# Altium schematic sheet AnalogSense.SchDoc: =TITLE
size A3; DocumentNumber: 11; SheetNumber: 11; SheetTotal: 11
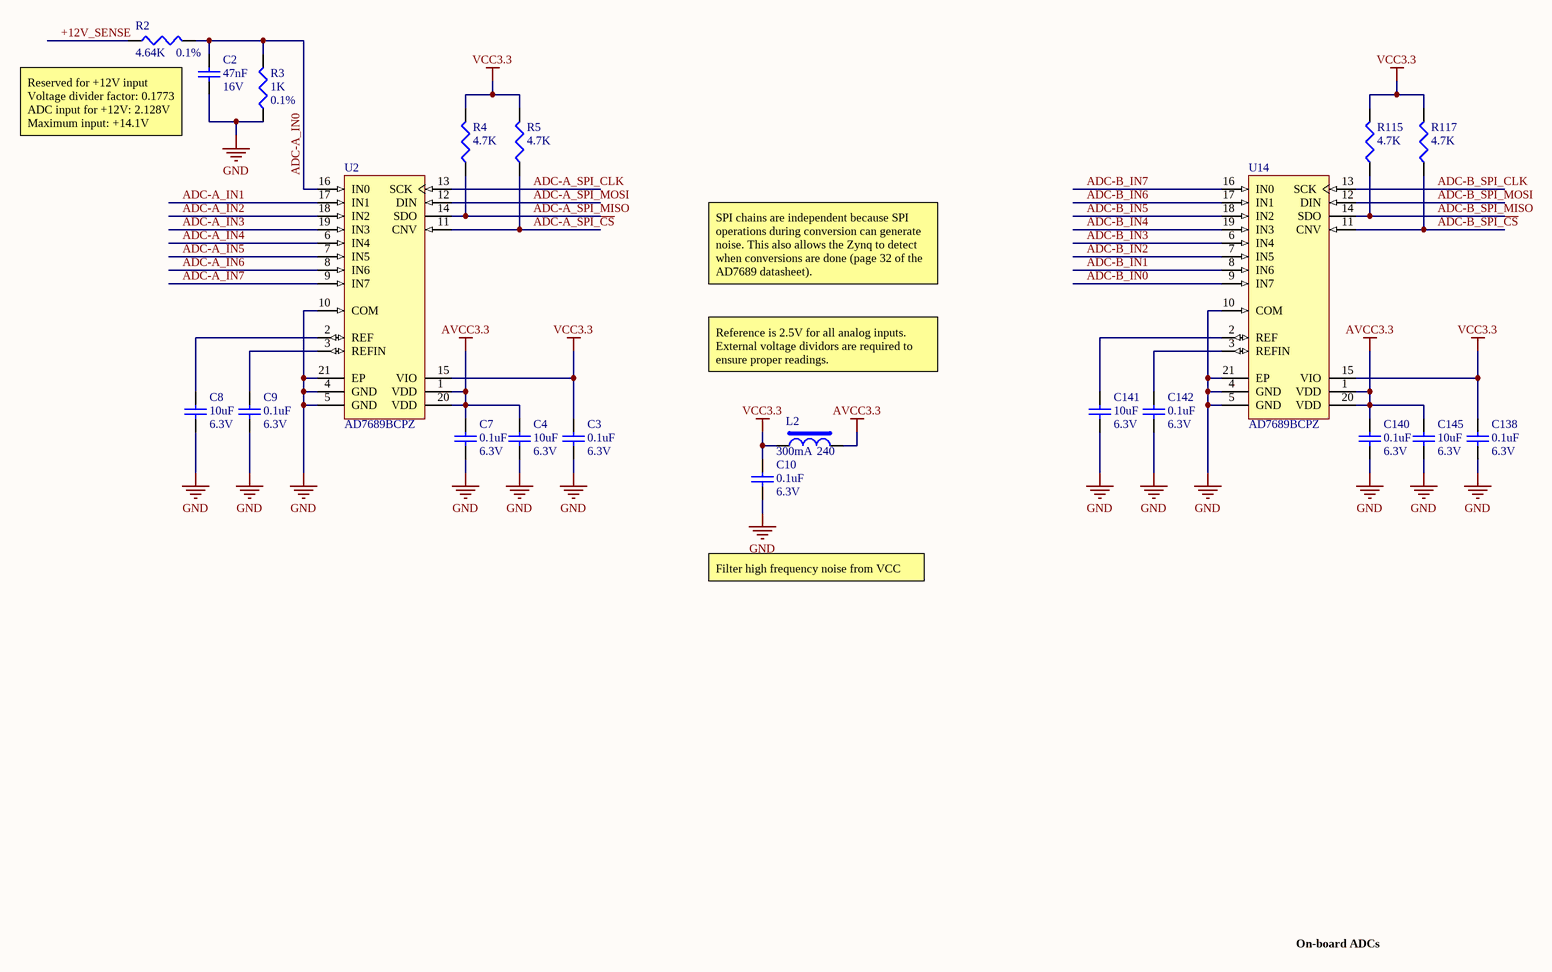
[diagram p0: AnalogSense.SchDoc]

## Parts
C2  value 47nF  Rating: 16V  [C0402_IPC_H]  (hidden comment: ?)
C3  value 0.1uF  Rating: 6.3V  [C0201_IPC_H]  (hidden comment: ?)
C4  value 10uF  Rating: 6.3V  [C0402_IPC_H]  (hidden comment: ?)
C7  value 0.1uF  Rating: 6.3V  [C0201_IPC_H]  (hidden comment: ?)
C8  value 10uF  Rating: 6.3V  [C0402_IPC_H]  (hidden comment: ?)
C9  value 0.1uF  Rating: 6.3V  [C0201_IPC_H]  (hidden comment: ?)
C10  value 0.1uF  Rating: 6.3V  [C0201_IPC_H]  (hidden comment: ?)
C138  value 0.1uF  Rating: 6.3V  [C0201_IPC_H]  (hidden comment: ?)
C140  value 0.1uF  Rating: 6.3V  [C0201_IPC_H]  (hidden comment: ?)
C141  value 10uF  Rating: 6.3V  [C0402_IPC_H]  (hidden comment: ?)
C142  value 0.1uF  Rating: 6.3V  [C0201_IPC_H]  (hidden comment: ?)
C145  value 10uF  Rating: 6.3V  [C0402_IPC_H]  (hidden comment: ?)
L2  value 240  Rated Current: 300mA  [L0402_H]  (hidden comment: BK1005HM241-T)
R2  value 4.64K  Tolerance: 0.1%  [R0603]  (hidden comment: ?)
R3  value 1K  Tolerance: 0.1%  [R0402_IPC_H]  (hidden comment: ?)
R4  value 4.7K  [R0402_IPC_H]  (hidden comment: ?)
R5  value 4.7K  [R0402_IPC_H]  (hidden comment: ?)
R115  value 4.7K  [R0402_IPC_H]  (hidden comment: ?)
R117  value 4.7K  [R0402_IPC_H]  (hidden comment: ?)
U2  AD7689BCPZ  [CP-20-4_N]
U14  AD7689BCPZ  [CP-20-4_N]

## Nets
AVCC3.3: C4.2 C7.2 C140.2 C145.2 L2.2 U2.1(VDD) U2.20(VDD) U14.1(VDD) U14.20(VDD)
GND: C2.1 C3.1 C4.1 C7.1 C8.1 C9.1 C10.1 C138.1 C140.1 C141.1 C142.1 C145.1 R3.1 U2.4(GND) U2.5(GND) U2.10(COM) U2.21(EP) U14.4(GND) U14.5(GND) U14.10(COM) U14.21(EP)
VCC3.3: C3.2 C10.2 C138.2 L2.1 R4.2 R5.2 R115.2 R117.2 U2.15(VIO) U14.15(VIO)
+12V_SENSE: R2.1
~{ADC-A_SPI_CS}: R5.1 U2.11(CNV)
~{ADC-B_SPI_CS}: R117.1 U14.11(CNV)
ADC-A_IN0: C2.2 R2.2 R3.2 U2.16(IN0)
ADC-A_IN1: U2.17(IN1)
ADC-A_IN2: U2.18(IN2)
ADC-A_IN3: U2.19(IN3)
ADC-A_IN4: U2.6(IN4)
ADC-A_IN5: U2.7(IN5)
ADC-A_IN6: U2.8(IN6)
ADC-A_IN7: U2.9(IN7)
ADC-A_SPI_CLK: U2.13(SCK)
ADC-A_SPI_MISO: R4.1 U2.14(SDO)
ADC-A_SPI_MOSI: U2.12(DIN)
ADC-B_IN0: U14.9(IN7)
ADC-B_IN1: U14.8(IN6)
ADC-B_IN2: U14.7(IN5)
ADC-B_IN3: U14.6(IN4)
ADC-B_IN4: U14.19(IN3)
ADC-B_IN5: U14.18(IN2)
ADC-B_IN6: U14.17(IN1)
ADC-B_IN7: U14.16(IN0)
ADC-B_SPI_CLK: U14.13(SCK)
ADC-B_SPI_MISO: R115.1 U14.14(SDO)
ADC-B_SPI_MOSI: U14.12(DIN)
NetC8_2: C8.2 U2.2(REF)
NetC9_2: C9.2 U2.3(REFIN)
NetC141_2: C141.2 U14.2(REF)
NetC142_2: C142.2 U14.3(REFIN)

## Notes on the sheet
- Reserved for +12V input
  Voltage divider factor: 0.1773
  ADC input for +12V: 2.128V
  Maximum input: +14.1V
- SPI chains are independent because SPI operations during conversion can generate noise. This also allows the Zynq to detect when conversions are done (page 32 of the AD7689 datasheet).
- Reference is 2.5V for all analog inputs. External voltage dividors are required to ensure proper readings.
- Filter high frequency noise from VCC
- On-board ADCs
- Description
- Title
- Size:
- Date:
- A3
- Number:
- Time:
- Revision:
- Sheet
- of
- File:
- Author:

## Library data of the parts
C2 = Cap: Capacitor; Part: GRM155R71C473KA01D; Manufacturer: Murata; INVKEY: CP0402-47nf-16V-10%; PackageDescription: Chip Capacitor
C3 C7 C9 C10 C138 C140 C142 = Cap: Capacitor; Manufacturer: Murata; Part: GRM033R60J104KE19D; INVKEY: CP0201-0.1UF-6.3V-10%; PackageDescription: Chip Capacitor
C4 C8 C141 C145 = Cap: Capacitor; Manufacturer: Murata; Part: GRM155R60J106ME44D; INVKEY: CP0402-10UF-6V3-20%; PackageDescription: Chip Capacitor
L2 = Bead: Bead Inductor; Manufacturer: Taiyo Yuden; Measuring Frequency: 100MHz; INVKEY: FB-BK1005HM241-T; PackageDescription: Chip Inductor; Part: BK1005HM241-T
R2 = Res: Resistor; Manufacturer: Susumu Co Ltd; Part: RG1608P-4641-B-T1; INVKEY: RS0603-4K64-1/10W-PREC; PackageDescription: Chip Resistor
R3 = Res: Resistor; Manufacturer: Vishay; Part: TNPW04021K00BEED; INVKEY: RS0402-1K-1/16W-PREC; PackageDescription: Chip Resistor
R4 R5 R115 R117 = Res: Resistor; Manufacturer: Panasonic; Part: ERJ-2RKF4701X; Tolerance: 1%; INVKEY: RS0402-4K7-1/10W-1%; PackageDescription: Chip Resistor
U2 U14 = CMP-0313-00576-2: Octal 16-Bit PulSAR Analog-to-Digital Converter with Serial, SPI Interface, 250KSPS, -40 to +85 degC, CP-20-4, Pb-Free, Tube; Generic Part Number: AD7689; Manufacturer: Analog; Throughput Rate (SPS): 250K; Resolution (Bits): 16; Interface: Ser, SPI; Channels: 8; INVKEY: IC-ADC-AD7689BCPZ; PackageReference: CP-20-4; ComponentLink1Description: Manufacturer URL; Packing: Tube; ComponentLink3Description: Package Specification; RoHS: Y; ComponentLink4Description: Product URL; ComponentLink3URL: http://www.analog.com/static/imported-files/packages/PKG_PDF/LFCSP(CP)/CP_20_4.pdf; ComponentLink1URL: http://www.analog.com/en/index.html; ComponentLink4URL: http://www.analog.com/en/analog-to-digital-converters/ad-converters/ad7689/products/product.html; PackageVersion: 012508-B; ComponentLink2Description: Datasheet; ComponentLink2URL: http://www.analog.com/static/imported-files/data_sheets/AD7682_7689.pdf; PackageDescription: 20-Lead Lead Frame Chip Scale Package [LFCSP_VQ] 4 x 4 mm Body, Very Thin Quad; Mounting Technology: Surface Mount; Code_JEDEC: MO-220-VGGD-1; DatasheetVersion: Rev.D; PartNumber: AD7689BCPZ; Part: AD7689BCPZ